# EAGLE design Relay Breakout (EAGLE 6.4)
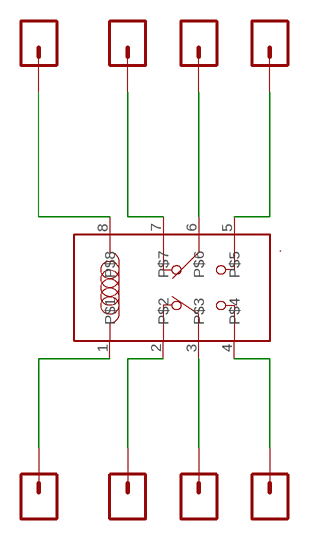
[diagram p0: schematic, sheet 1]

## Parts
.  IM21IM21-THT  [THT]
JP3  M01PTH  [1X01]
JP4  M01PTH  [1X01]
JP5  M01PTH  [1X01]
JP6  M01PTH  [1X01]
JP7  M01PTH  [1X01]
JP8  M01PTH  [1X01]
JP9  M01PTH  [1X01]
JP10  M01PTH  [1X01]

## Nets
N$1: ..8 JP10.1
N$2: ..7 JP9.1
N$3: ..6 JP8.1
N$4: ..5 JP7.1
N$5: ..4 JP6.1
N$6: ..3 JP5.1
N$7: ..2 JP4.1
N$8: ..1 JP3.1

## Library data of the parts
. = IM21-DPDT Relay, 3v:IM21
JP3-JP10 = SparkFun-Connectors:M01: Header 1 Standard 1-pin 0.1" header. Use with straight break away headers (SKU : PRT-00116), right angle break away headers (PRT-00553), swiss pins (PRT-00743), machine pins (PRT-00117), and female headers (PRT-00115).

## Board
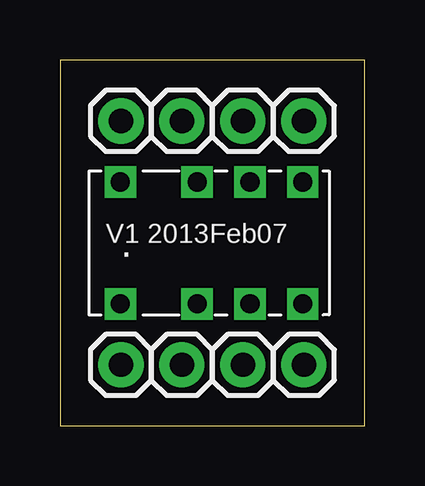
[diagram p1: board, top side]
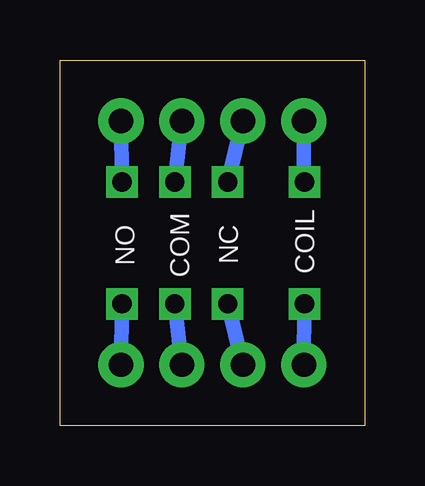
[diagram p2: board, bottom side, seen from below]

Size 12.7 x 15.24 mm. Coordinates in mm from the lower left corner, seen from the top.
Outline: 0,0 12.7,0 12.7,15.24 0,15.24 0,0
Copper layers (1*16): Top 0.035mm / dielectric 1.5mm / Bottom 0.035mm
Design rules "default": minimum track width 10mil, minimum drill 24mil, track to track 8mil, track to pad 8mil, pad to pad 8mil, via to via 8mil, smd to smd 8mil, copper to edge 40mil, drill to drill 8mil, minimum pad ring 10mil, minimum via ring 8mil, stop-mask expansion 4mil, vias tented up to drill 0mil, thermal gap 10mil

### Footprints (pad centres in the part's own frame; a part is rotated, then mirrored left to right if it is on the bottom)
THT = drill 0.8 square: 1 -3.2,-2.54; 2 0,-2.54; 3 2.2,-2.54; 4 4.4,-2.54; 5 4.4,2.54; 6 2.2,2.54; 7 0,2.54; 8 -3.2,2.54
1X01 = drill 1.016 pad 1.88: 1 0,0

### Placement (x,y rotation side)
.  5.71,7.62 0 top
JP3  2.54,2.54 0 top
JP4  5.08,2.54 0 top
JP5  7.62,2.54 0 top
JP6  10.16,2.54 0 top
JP7  10.16,12.7 0 top
JP8  7.62,12.7 0 top
JP9  5.08,12.7 0 top
JP10  2.54,12.7 0 top

### Tracks (layer width: path | path; a pad name or v marks a point on that pad's centre or on a via)
N$1
  Bottom 0.61: ..8 2.54,10.16 JP10.1
N$2
  Bottom 0.61: ..7 JP9.1
N$3
  Bottom 0.61: ..6 JP8.1
N$4
  Bottom 0.61: ..5 JP7.1
N$5
  Bottom 0.61: JP6.1 ..4
N$6
  Bottom 0.61: JP5.1 ..3
N$7
  Bottom 0.61: JP4.1 ..2
N$8
  Bottom 0.61: JP3.1 ..1

### Text on the board
tPlace: V1 2013Feb07
bPlace: COIL | COM | NC | NO